# EAGLE design LED_2 (EAGLE 7.2.0)
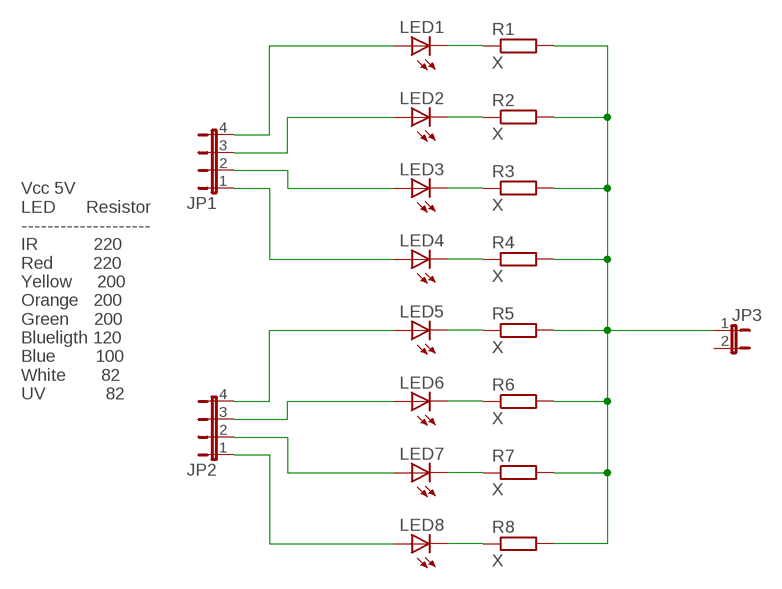
[diagram p0: schematic, sheet 1]

## Parts
JP1  JP4E  [JP4]
JP2  JP4E  [JP4]
JP3  JP1E  [JP1]
LED1  LED5MM  [LED5MM]
LED2  LED5MM  [LED5MM]
LED3  LED5MM  [LED5MM]
LED4  LED5MM  [LED5MM]
LED5  LED5MM  [LED5MM]
LED6  LED5MM  [LED5MM]
LED7  LED5MM  [LED5MM]
LED8  LED5MM  [LED5MM]
R1  X  R-EU_0411/3V  [0411V]
R2  X  R-EU_0411/3V  [0411V]
R3  X  R-EU_0411/3V  [0411V]
R4  X  R-EU_0411/3V  [0411V]
R5  X  R-EU_0411/3V  [0411V]
R6  X  R-EU_0411/3V  [0411V]
R7  X  R-EU_0411/3V  [0411V]
R8  X  R-EU_0411/3V  [0411V]

## Nets
N$1: LED2.K(C) R2.1
N$2: LED3.K(C) R3.1
N$3: LED4.K(C) R4.1
N$4: LED5.K(C) R5.1
N$5: LED6.K(C) R6.1
N$6: LED7.K(C) R7.1
N$7: LED8.K(C) R8.1
N$8: LED1.K(C) R1.1
N$9: JP1.4 LED1.A
N$10: JP1.3 LED2.A
N$11: JP1.2 LED3.A
N$12: JP1.1 LED4.A
N$13: JP2.4 LED5.A
N$14: JP2.3 LED6.A
N$15: JP2.2 LED7.A
N$16: JP2.1 LED8.A
N$17: JP3.1 R1.2 R2.2 R3.2 R4.2 R5.2 R6.2 R7.2 R8.2
Unconnected: JP3.2

## Notes on the sheet
- Vcc 5V
  LED      Resistor
  --------------------
  IR           220
  Red        220
  Yellow     200
  Orange   200
  Green     200
  Blueligth 120
  Blue        100
  White       82
  UV            82

## Library data of the parts
JP1 JP2 = jumper:JP4E: JUMPER
JP3 = jumper:JP1E: JUMPER
LED1-LED8 = adafruit:LED: LED OSRAM: - CHIPLED LG R971, LG N971, LY N971, LG Q971, LY Q971, LO R971, LY R971 LH N974, LH R974 LS Q976, LO Q976, LY Q976 LO Q996 - Hyper CHIPLED LW Q18S LB Q993, LB Q99A, LB R99A - SideLED LS A670, LO A670, LY A670, LG A670, LP A670 LB A673, LV A673, LT A673, LW A673 LH A674 LY A675 LS A676, LA A676, LO A676, LY A676, LW A676 LS A679, LY A679, LG A679 - Hyper Micro SIDELED® LS Y876, LA Y876, LO Y876, LY Y876 LT Y87S - SmartLED LW L88C, LW L88S LB L89C, LB L89S, LG L890 LS L89K, LO L89K, LY L89K LS L896, LA L896, LO L896, LY L896 - TOPLED LS T670, LO T670, LY T670, LG T670, LP T670 LSG T670, LSP T670, LSY T670, LOP T670, LYG T670 LG T671, LOG T671, LSG T671 LB T673, LV T673, LT T673, LW T673 LH T674 LS T676, LA T676, LO T676, LY T676, LB T676, LH T676, LSB T676, LW T676 LB T67C, LV T67C, LT T67C, LS T67K, LO T67K, LY T67K, LW E67C LS E67B, LA E67B, LO E67B, LY E67B, LB E67C, LV E67C, LT E67C LW T67C LS T679, LY T679, LG T679 LS T770, LO T770, LY T770, LG T770, LP T770 LB T773, LV T773, LT T773, LW T773 LH T774 LS E675, LA E675, LY E675, LS T675 LS T776, LA T776, LO T776, LY T776, LB T776 LHGB T686 LT T68C, LB T68C - Hyper Mini TOPLED® LB M676 - Mini TOPLED Santana® LG M470 LS M47K, LO M47K, LY M47K Source: http://www.osram.convergy.de/
R1-R8 = rcl:R-EU_: RESISTOR, European symbol

## Board
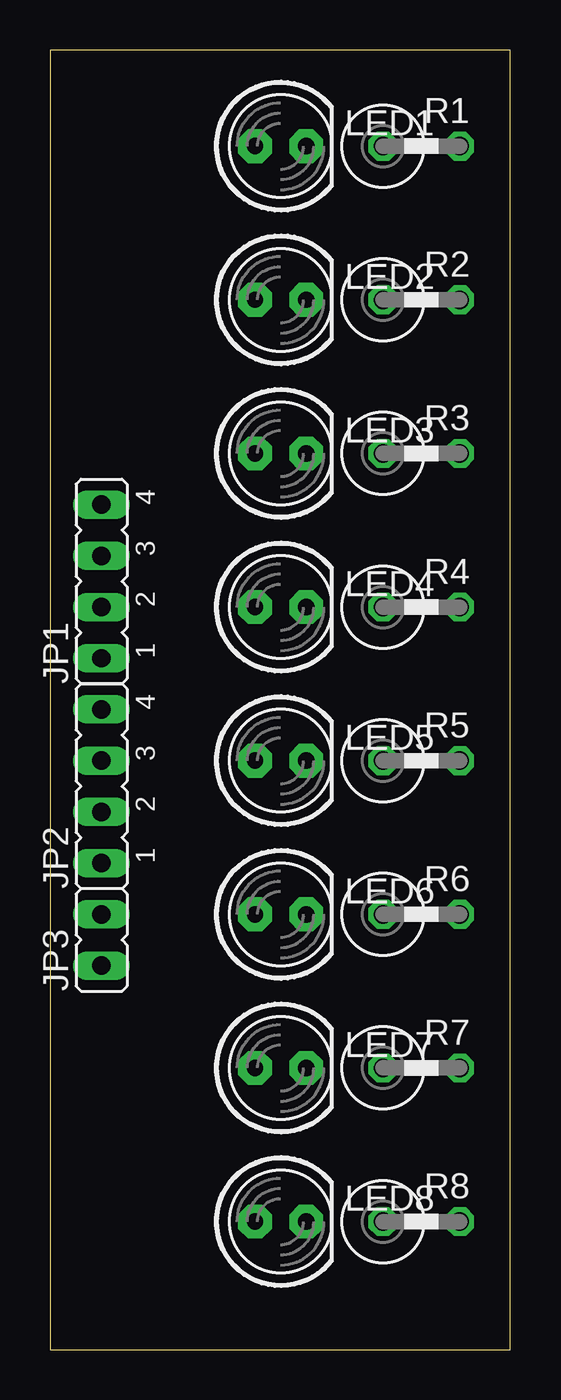
[diagram p1: board, top side]
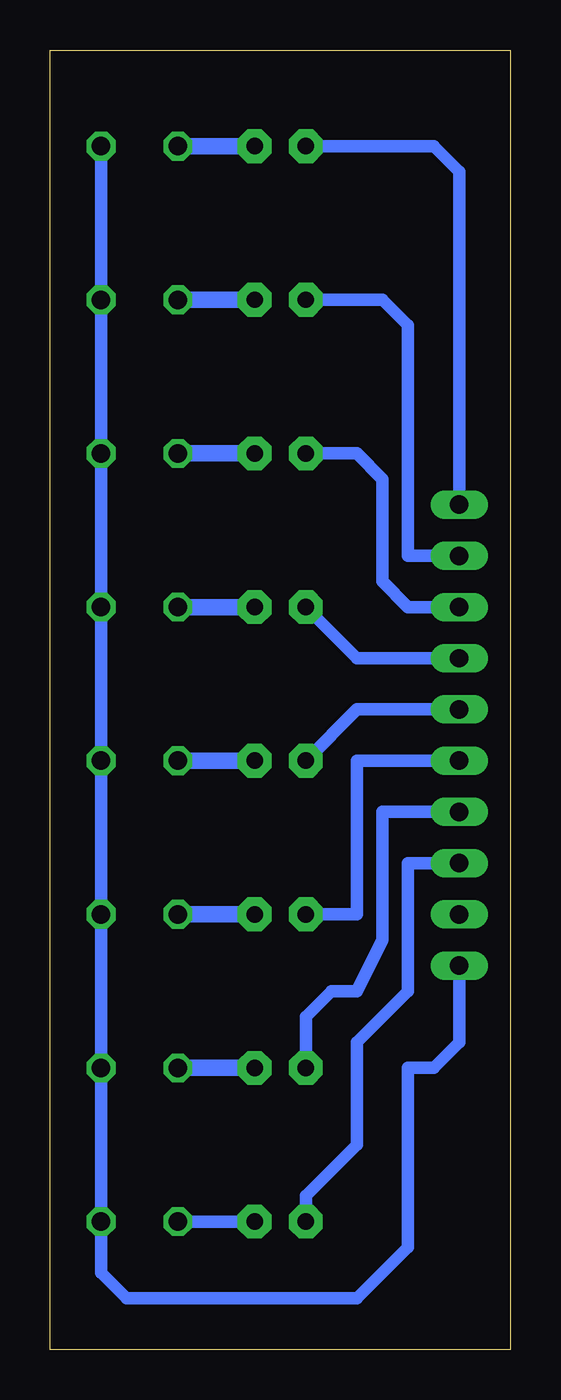
[diagram p2: board, bottom side, seen from below]

Size 22.84 x 64.44 mm. Coordinates in mm from the lower left corner, seen from the top.
Outline: 0,0 22.84,0 22.84,64.44 0,64.44 0,0
Copper layers (1*16): Top 0.035mm / dielectric 1.5mm / Bottom 0.035mm
Design rules "default": minimum track width 10mil, minimum drill 24mil, track to track 8mil, track to pad 8mil, pad to pad 8mil, via to via 8mil, smd to smd 8mil, copper to edge 40mil, drill to drill 8mil, minimum pad ring 10mil, minimum via ring 8mil, stop-mask expansion 4mil, vias tented up to drill 0mil, thermal gap 10mil

### Footprints (pad centres in the part's own frame; a part is rotated, then mirrored left to right if it is on the bottom)
JP4 = drill 0.914 long: 1 -3.81,0; 2 -1.27,0; 3 1.27,0; 4 3.81,0
JP1 = drill 0.914 long: 1 0,-1.27; 2 0,1.27
LED5MM = drill 0.813 pad 1.676 octagon: A -1.27,0; K 1.27,0
0411V = drill 0.914 octagon: 1 -2.54,0; 2 1.27,0

### Placement (x,y rotation side)
JP1  2.54,38.1 90 top
JP2  2.54,27.94 90 top
JP3  2.54,20.32 0 top
LED1  11.43,59.69 0 top
LED2  11.43,52.07 0 top
LED3  11.43,44.45 0 top
LED4  11.43,36.83 0 top
LED5  11.43,29.21 0 top
LED6  11.43,21.59 0 top
LED7  11.43,13.97 0 top
LED8  11.43,6.35 0 top
R1  19.05,59.69 0 top
R2  19.05,52.07 0 top
R3  19.05,44.45 0 top
R4  19.05,36.83 0 top
R5  19.05,29.21 0 top
R6  19.05,21.59 0 top
R7  19.05,13.97 0 top
R8  19.05,6.35 0 top

### Tracks (layer width: path | path; a pad name or v marks a point on that pad's centre or on a via)
N$1
  Bottom 0.813: LED2.K R2.1
N$2
  Bottom 0.813: LED3.K R3.1
N$3
  Bottom 0.813: LED4.K R4.1
N$4
  Bottom 0.813: LED5.K R5.1
N$5
  Bottom 0.813: LED6.K R6.1
N$6
  Bottom 0.813: LED7.K R7.1
N$7
  Bottom 0.61: LED8.K R8.1
N$8
  Bottom 0.813: LED1.K R1.1
N$9
  Bottom 0.61: JP1.4 2.54,58.42 3.81,59.69 LED1.A
N$10
  Bottom 0.61: JP1.3 5.08,39.37 5.08,50.8 6.35,52.07 LED2.A
N$11
  Bottom 0.61: JP1.2 5.08,36.83 6.35,38.1 6.35,43.18 7.62,44.45 LED3.A
N$12
  Bottom 0.61: JP1.1 7.62,34.29 LED4.A
N$13
  Bottom 0.61: JP2.4 7.62,31.75 LED5.A
N$14
  Bottom 0.61: JP2.3 7.62,29.21 7.62,21.59 LED6.A
N$15
  Bottom 0.61: JP2.2 6.35,26.67 6.35,20.32 7.62,17.78 8.89,17.78 10.16,16.51 LED7.A
N$16
  Bottom 0.61: JP2.1 5.08,24.13 5.08,17.78 7.62,15.24 7.62,10.16 10.16,7.62 LED8.A
N$17
  Bottom 0.61: JP3.1 2.54,15.24 3.81,13.97 5.08,13.97 5.08,5.08 7.62,2.54 19.05,2.54 20.32,3.81 R8.2 R7.2 R6.2 R5.2 R4.2 R3.2 R2.2 R1.2